# EAGLE design I6ABreakout (EAGLE 8.3.2)
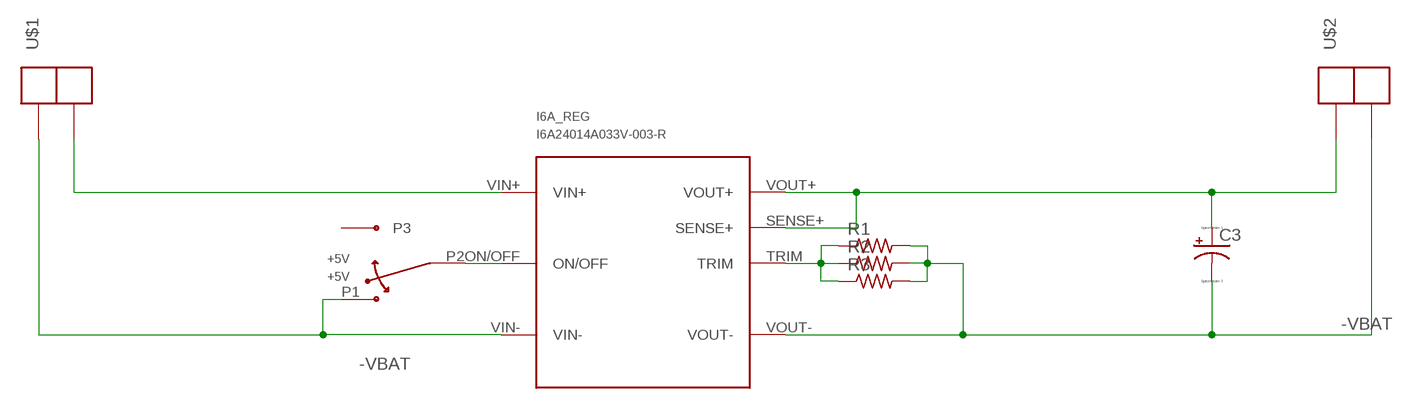
[diagram p0: schematic, sheet 1]

## Parts
+5V  +5V  SPDT-TOGGLE  [SPDT-TOGGLE]
C3  CPOL-USD/7343-31R  [D/7343-31R]
I6A_REG  I6A24014A033V-003-R  I6A  [I6A]
R1  R-US_M0805  [M0805]
R2  R-US_M0805  [M0805]
R3  R-US_M0805  [M0805]
U$1  2PIN-HEADERANDERSON_RIGHTANGLE  [ANDERSON_RIGHTANGLE_X2]
U$2  2PIN-HEADERANDERSON_RIGHTANGLE  [ANDERSON_RIGHTANGLE_X2]

## Nets
+5V: C3.+ I6A_REG.SENSE+ I6A_REG.VOUT+ U$2.P1
+VBAT: I6A_REG.VIN+ U$1.P2
-VBAT: +5V.P1 C3.- I6A_REG.VIN- I6A_REG.VOUT- R1.2 R2.2 R3.2 U$1.P1 U$2.P2
N$1: +5V.P2 I6A_REG.ON/OFF
VTRIM1: I6A_REG.TRIM R1.1 R2.1 R3.1
Unconnected: +5V.P3

## Library data of the parts
+5V = switch:SPDT-TOGGLE: SPDT TOGGLE SWITCH
C3 = resistor:CPOL-US: POLARIZED CAPACITOR, American symbol
I6A_REG = converterModules:I6A: TDK LAMBDA i6A BUCK CONVERTER Full Feature: 11 pin POL module (1/16 brick) 9-40V Input, 250W, 3.3-24V Output DATASHEET: www.mouser.com/ds/2/400/i6a-769886.pdf to 5V (4.47k tied up) custom
R1-R3 = rcl:R-US_: RESISTOR, American symbol
U$1 U$2 = 000_CustomPartsMaster:2PIN-HEADER

## Board
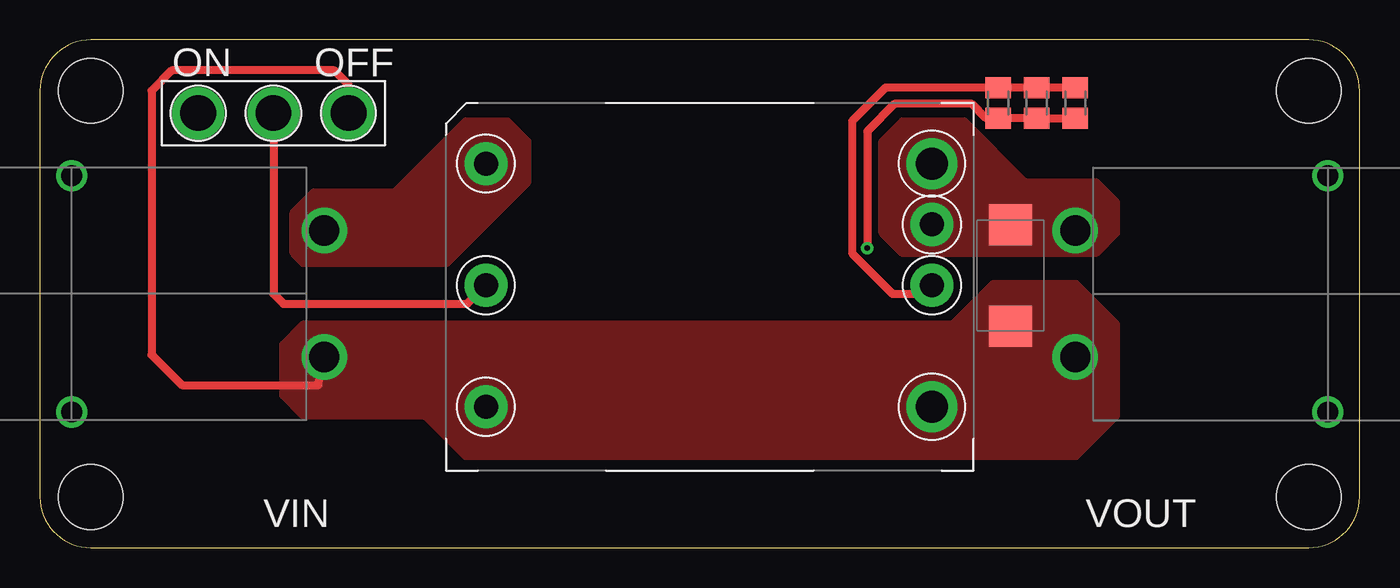
[diagram p1: board, top side]
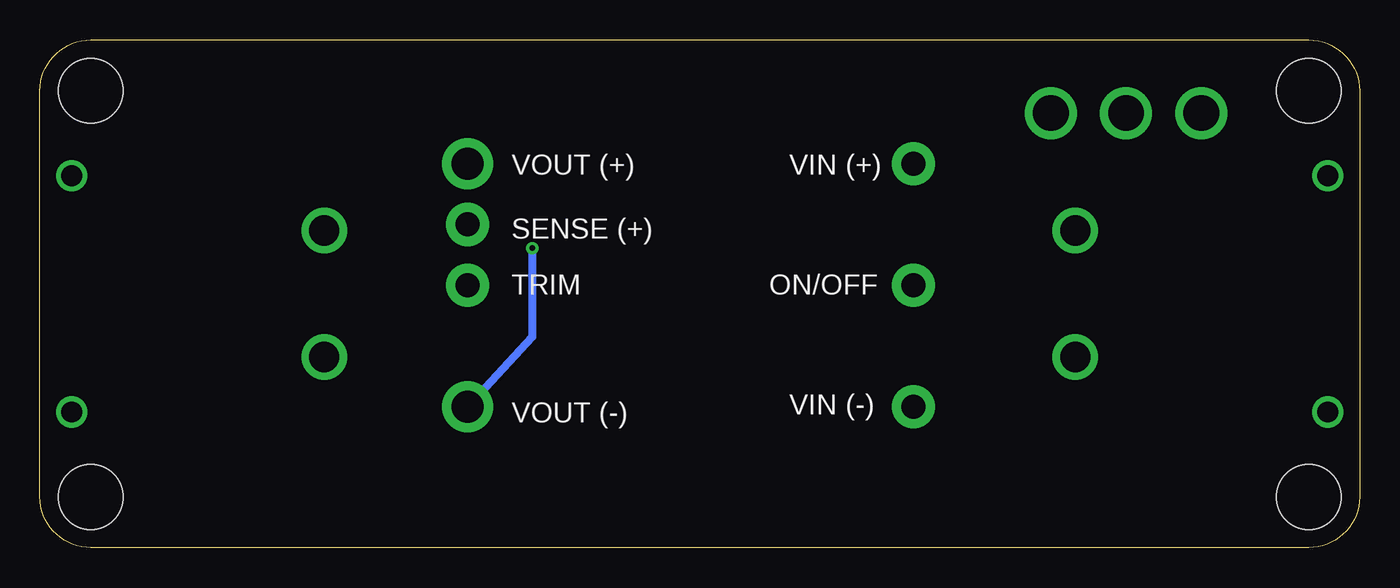
[diagram p2: board, bottom side, seen from below]

Size 82.55 x 31.75 mm. Coordinates in mm from the lower left corner, seen from the top.
Outline: 0,28.57 0,3.17 arc90 3.17,0 79.38,0 arc90 82.55,3.17 82.55,28.57 arc90 79.38,31.75 3.17,31.75 arc90 0,28.57
Copper layers (1*16): Top 0.035mm / dielectric 1.5mm / Bottom 0.035mm
Design rules "default": minimum track width 6mil, minimum drill 0.35mm, track to track 6mil, track to pad 6mil, pad to pad 6mil, via to via 6mil, smd to smd 6mil, copper to edge 40mil, drill to drill 6mil, minimum pad ring 10mil, minimum via ring 8mil, stop-mask expansion 4mil, vias tented up to drill 0mil, thermal gap 10mil
Holes 4.05 mm at 3.17,28.57 3.17,3.17 79.38,3.17 79.38,28.57

### Footprints (pad centres in the part's own frame; a part is rotated, then mirrored left to right if it is on the bottom)
SPDT-TOGGLE = drill 2.235: P1 0,4.7; P2 0,0; P3 0,-4.7
D/7343-31R = smd 2.55 x 2.7: + 3.175,0; - -3.175,0
I6A = drill 1.5 pad 2.7: ON/OFF 2.5,-11.4; SENSE+ 30.4,-7.6; TRIM 30.4,-11.4; VIN+ 2.5,-3.8; VIN- 2.5,-19 | drill 2 pad 3.2: VOUT+ 30.4,-3.8; VOUT- 30.4,-19
M0805 = smd 1.3 x 1.6: 1 -0.95,0; 2 0.95,0
ANDERSON_RIGHTANGLE_X2 = drill 1.9: P1 -3.95,0; P2 3.95,0 | drill 1.3: STAPLE1 -7.39,15.8; STAPLE2 7.39,15.8

### Placement (x,y rotation side)
+5V  14.61,27.18 270 top
C3  60.71,17.02 90 top
I6A_REG  25.4,27.81 0 top
R1  64.77,27.81 270 top
R2  62.36,27.81 270 top
R3  59.94,27.81 270 top
U$1  17.78,15.88 90 top
U$2  64.77,15.88 270 top

### Tracks (layer width: path | path; a pad name or v marks a point on that pad's centre or on a via)
+5V
  pour Top (no thermals): 52.7,25.4 53.98,26.67 57.78,26.67 61.59,22.86 66.04,22.86 67.31,21.59 67.31,19.68 66.04,18.41 53.98,18.41 52.7,19.68
+VBAT
  pour Top (no thermals): 15.88,20.95 17.14,22.23 22.23,22.23 26.67,26.67 29.21,26.67 30.48,25.4 30.48,22.86 25.4,17.78 16.51,17.78 15.88,18.41
-VBAT  (via drill 0.35)
  Top 0.508: R1.2 R2.2 R3.2 59.18,26.86 58.29,27.75 53.47,27.75 51.75,26.04 v51.75,18.73 | +5V.P1 19.3,28.95 18.41,29.84 8.26,29.84 6.99,28.57 6.99,12.06 8.89,10.16 17.41,10.16 U$1.P1
  Bottom 0.508: v51.75,18.73 51.75,13.18 I6A_REG.VOUT-
  pour Top (no thermals): 15.24,12.7 16.51,13.97 57.15,13.97 59.69,16.51 64.77,16.51 67.31,13.97 67.31,8.26 64.77,5.71 26.67,5.71 24.13,8.26 16.51,8.26 15.24,9.53
N$1
  Top 0.508: +5V.P2 14.61,15.88 15.24,15.24 26.73,15.24 I6A_REG.ON/OFF
VTRIM1
  Top 0.508: R1.1 R2.1 R3.1 52.89,28.76 50.8,26.67 50.8,18.41 53.34,15.88 55.26,15.88 I6A_REG.TRIM

### Text on the board
tPlace: ON | OFF | VIN | VOUT